# Altium schematic sheet Ethernet.SchDoc
size 420 x 297 mm; Address1: Address1; Address2: Address2; Address3: Address3; Address4: Address4; DocumentNumber: *Э3; SheetNumber: 9; SheetTotal: 10; DocumentType: Схема электрическая *
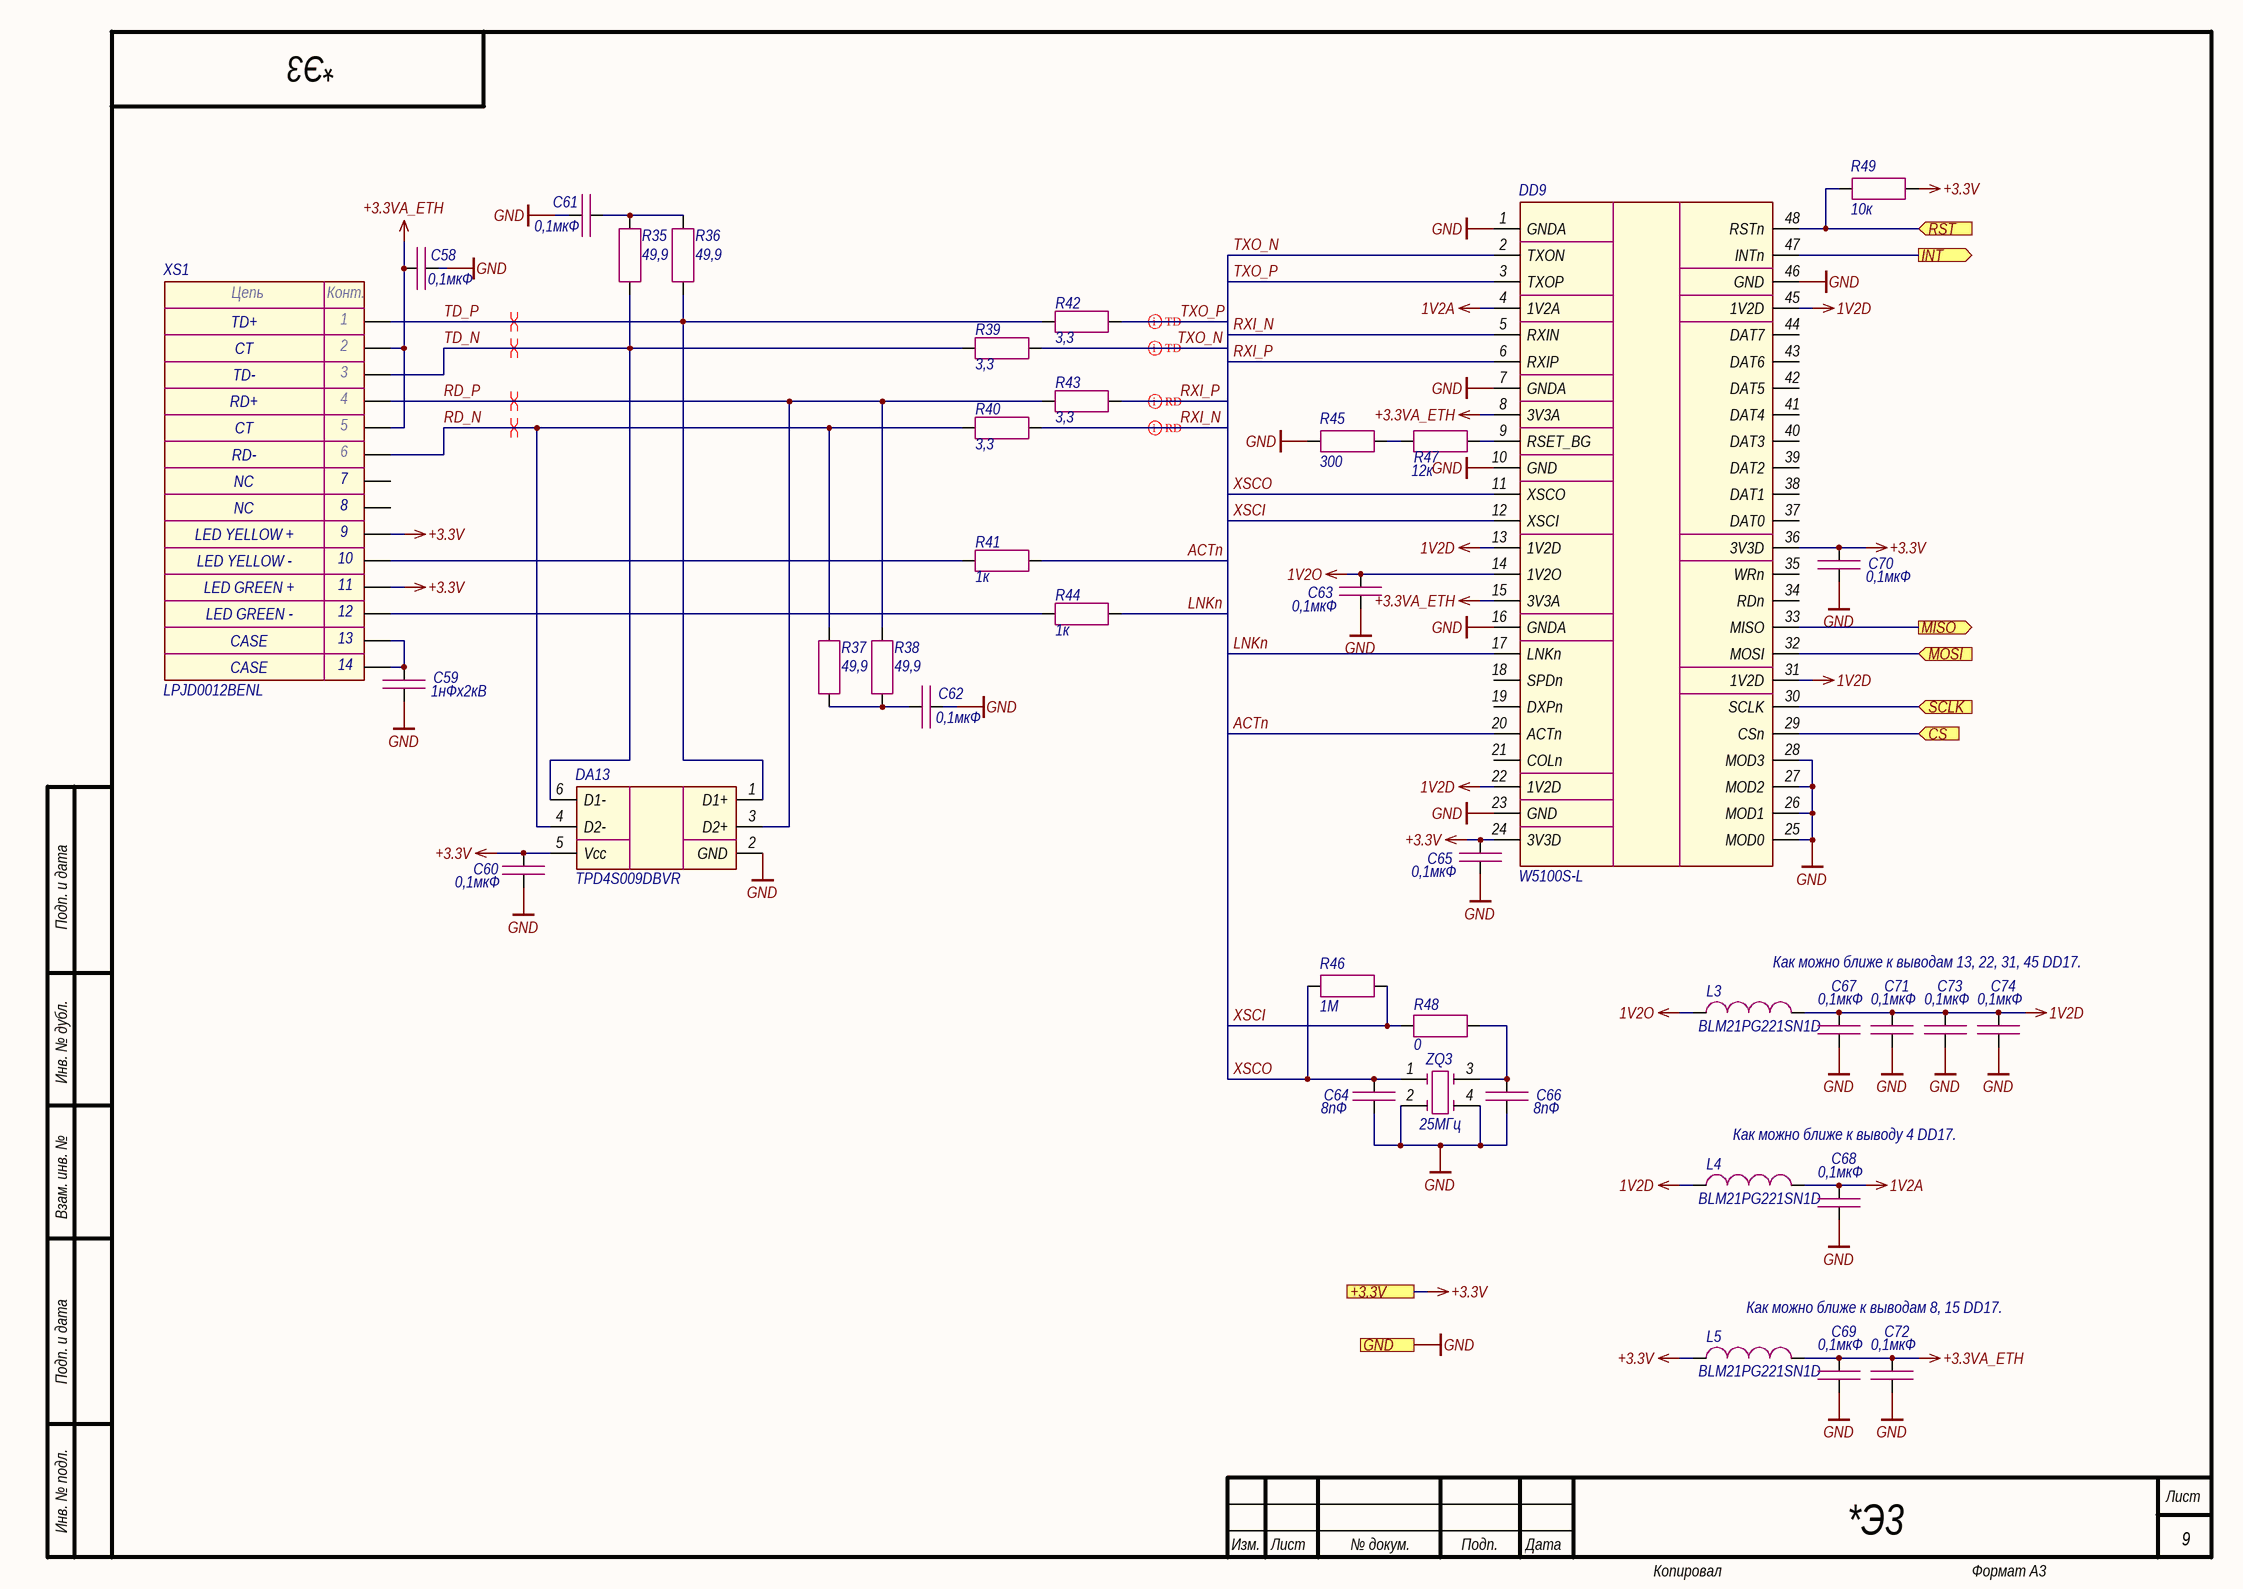
[diagram p0: Ethernet.SchDoc]

## Parts
C58  0,1мкФ  [CAP_0603]
C59  1нФх2кВ  [CAP_1206]
C60  0,1мкФ  [CAP_0603]
C61  0,1мкФ  [CAP_0603]
C62  0,1мкФ  [CAP_0603]
C63  0,1мкФ  [CAP_0603]
C64  8пФ  [CAP_0603]
C65  0,1мкФ  [CAP_0603]
C66  8пФ  [CAP_0603]
C67  0,1мкФ  [CAP_0603]
C68  0,1мкФ  [CAP_0603]
C69  0,1мкФ  [CAP_0603]
C70  0,1мкФ  [CAP_0603]
C71  0,1мкФ  [CAP_0603]
C72  0,1мкФ  [CAP_0603]
C73  0,1мкФ  [CAP_0603]
C74  0,1мкФ  [CAP_0603]
DA13  TPD4S009DBVR  [SOT-23-6]
DD9  W5100S-L  [LQFP-48]
L3  BLM21PG221SN1D  [IND_0805]
L4  BLM21PG221SN1D  [IND_0805]
L5  BLM21PG221SN1D  [IND_0805]
R35  49,9  [RES_0603]
R36  49,9  [RES_0603]
R37  49,9  [RES_0603]
R38  49,9  [RES_0603]
R39  3,3  [RES_0603]
R40  3,3  [RES_0603]
R41  1к  [RES_0603]
R42  3,3  [RES_0603]
R43  3,3  [RES_0603]
R44  1к  [RES_0603]
R45  300  [RES_0603]
R46  1М  [RES_0603]
R47  12к  [RES_0603]
R48  0  [RES_0603]
R49  10к  [RES_0603]
XS1  LPJD0012BENL  [LPJD0012BENL]
ZQ3  25МГц  [7M]

## Ports
+3.3V (see Main[2B], Fiber_interlock[2C], Hardwiring[3D], LD_driver[1D], Power_supply[1D]), CS (in, see Main[2B]), GND (see Main[2B], Fiber_interlock[2C], Guide_laser[1C], Hardwiring[3D], Indication[1C], LD_driver[1D], Power_supply[1D]), INT (out, see Main[2B]), MISO (out, see Main[2B]), MOSI (in, see Main[2B]), RST (in, see Main[2B]), SCLK (in, see Main[2B])

## Nets
1V2A: C68.1 DD9.4(1V2A) L4.2
1V2D: C67.1 C71.1 C73.1 C74.1 DD9.13(1V2D) DD9.22(1V2D) DD9.31(1V2D) DD9.45(1V2D) L3.2 L4.1
1V2O: C63.1 DD9.14(1V2O) L3.1
+3.3V: C60.1 C65.1 C70.1 DA13.5(Vcc) DD9.24(3V3D) DD9.36(3V3D) L5.1 R49.2 XS1.9 XS1.11 ; port +3.3V
+3.3VA_ETH: C58.1 C69.1 C72.1 DD9.8(3V3A) DD9.15(3V3A) L5.2 XS1.2 XS1.5
GND: C58.2 C59.2 C60.2 C61.2 C62.2 C63.2 C64.2 C65.2 C66.2 C67.2 C68.2 C69.2 C70.2 C71.2 C72.2 C73.2 C74.2 DA13.2(GND) DD9.1(GNDA) DD9.7(GNDA) DD9.10(GND) DD9.16(GNDA) DD9.23(GND) DD9.25(MOD0) DD9.26(MOD1) DD9.27(MOD2) DD9.28(MOD3) DD9.46(GND) R45.1 ZQ3.2 ZQ3.4 ; port GND
ACTn: DD9.20(ACTn) R41.2
CS: DD9.29(CSn) ; port CS
INT: DD9.47(INTn) ; port INT
LNKn: DD9.17(LNKn) R44.2
MISO: DD9.33(MISO) ; port MISO
MOSI: DD9.32(MOSI) ; port MOSI
RD_N: DA13.4(D2-) R37.1 R40.2 XS1.6
RD_P: DA13.3(D2+) R38.1 R43.2 XS1.4
RST: DD9.48(RSTn) R49.1 ; port RST
RXI_N: DD9.5(RXIN) R40.1
RXI_P: DD9.6(RXIP) R43.1
SCLK: DD9.30(SCLK) ; port SCLK
TD_N: DA13.6(D1-) R35.1 R39.2 XS1.3
TD_P: DA13.1(D1+) R36.1 R42.2 XS1.1
TXO_N: DD9.2(TXON) R39.1
TXO_P: DD9.3(TXOP) R42.1
XSCI: DD9.12(XSCI) R46.2 R48.1
XSCO: C64.1 DD9.11(XSCO) R46.1 ZQ3.1
NetC59_1: C59.1 XS1.13 XS1.14
NetC61_1: C61.1 R35.2 R36.2
NetC62_1: C62.1 R37.2 R38.2
NetC66_1: C66.1 R48.2 ZQ3.3
NetDD9_9: DD9.9(RSET_BG) R47.2
NetR41_1: R41.1 XS1.10
NetR44_1: R44.1 XS1.12
NetR45_2: R45.2 R47.1

Not connected (* = marked no-connect by the designer): DD9 18(SPDn) 19(DXPn) 21(COLn) 34(RDn) 35(WRn) 37(DAT0) 38(DAT1) 39(DAT2) 40(DAT3) 41(DAT4) 42(DAT5) 43(DAT6) 44(DAT7); XS1 7 8

## Layout directives
differential pair; differential pair class TD: TXO_N, TXO_P
differential pair; differential pair class RD: RXI_N, RXI_P
differential pair: RD_N, RD_P, TD_N, TD_P

## Notes on the sheet
- Как можно ближе к выводам 13, 22, 31, 45 DD17.
- Как можно ближе к выводу 4 DD17.
- Как можно ближе к выводам 8, 15 DD17.
- Подп. и дата
- Инв. № дубл.
- Взам. инв. №
- Инв. № подл.
- Изм.
- Лист
- № докум.
- Подп.
- Дата
- Копировал
- Формат А3
- (in symbol LPJD0012BENL) Цепь; Конт.; TD+; CT; TD-; RD+; RD-; NC; LED YELLOW +; LED YELLOW -; LED GREEN +; LED GREEN -; CASE

## Library data of the parts
C58 C60-C63 C65 C67-C74 = Capacitor: Manufacturer: Murata; Model: GRM188R71H104KA93D; Value: 0,1мкФ; Document: *
C59 = Capacitor: Manufacturer: Yageo; Model: CC1206KKX7RDBB102; Value: 1нФх2кВ; Document: *
C64 C66 = Capacitor: Manufacturer: Yageo; Model: CC0603CRNPO9BN8R0; Value: 8пФ; Document: *
DA13 = TPD4S009: Manufacturer: Texas Instruments; Model: TPD4S009DBVR; Document: *
DD9 = W5100S: Manufacturer: Wiznet; Model: W5100S-L; Document: *
L3-L5 = Inductor: Manufacturer: Murata; Value: *; Model: BLM21PG221SN1D; Document: *
R35-R38 = Resistor: Manufacturer: Yageo; Model: RC0603FR-0749R9L; Value: 49,9; Document: *
R39 R40 R42 R43 = Resistor: Manufacturer: Yageo; Model: RC0603FR-073R3L; Value: 3,3; Document: *
R41 R44 = Resistor: Manufacturer: Yageo; Model: RC0603FR-071KL; Value: 1к; Document: *
R45 = Resistor: Manufacturer: Yageo; Model: RC0603FR-07300RL; Value: 300; Document: *
R46 = Resistor: Manufacturer: Yageo; Model: RC0603FR-071ML; Value: 1М; Document: *
R47 = Resistor: Manufacturer: Yageo; Model: RC0603FR-0712KL; Value: 12к; Document: *
R48 = Resistor: Manufacturer: Yageo; Model: RC0603JR-070RL; Value: 0; Document: *
R49 = Resistor: Manufacturer: Yageo; Model: RC0603FR-0710KL; Value: 10к; Document: *
XS1 = LPJD0012BENL: Manufacturer: LINK-PP; Model: LPJD0012BENL; Document: *
ZQ3 = Quartz_Resonator_4-pin: Manufacturer: TXC; Model: 7M-25.000MAAJ-T; Value: 25МГц; Document: *